# EAGLE design boost (EAGLE 8.6.0)
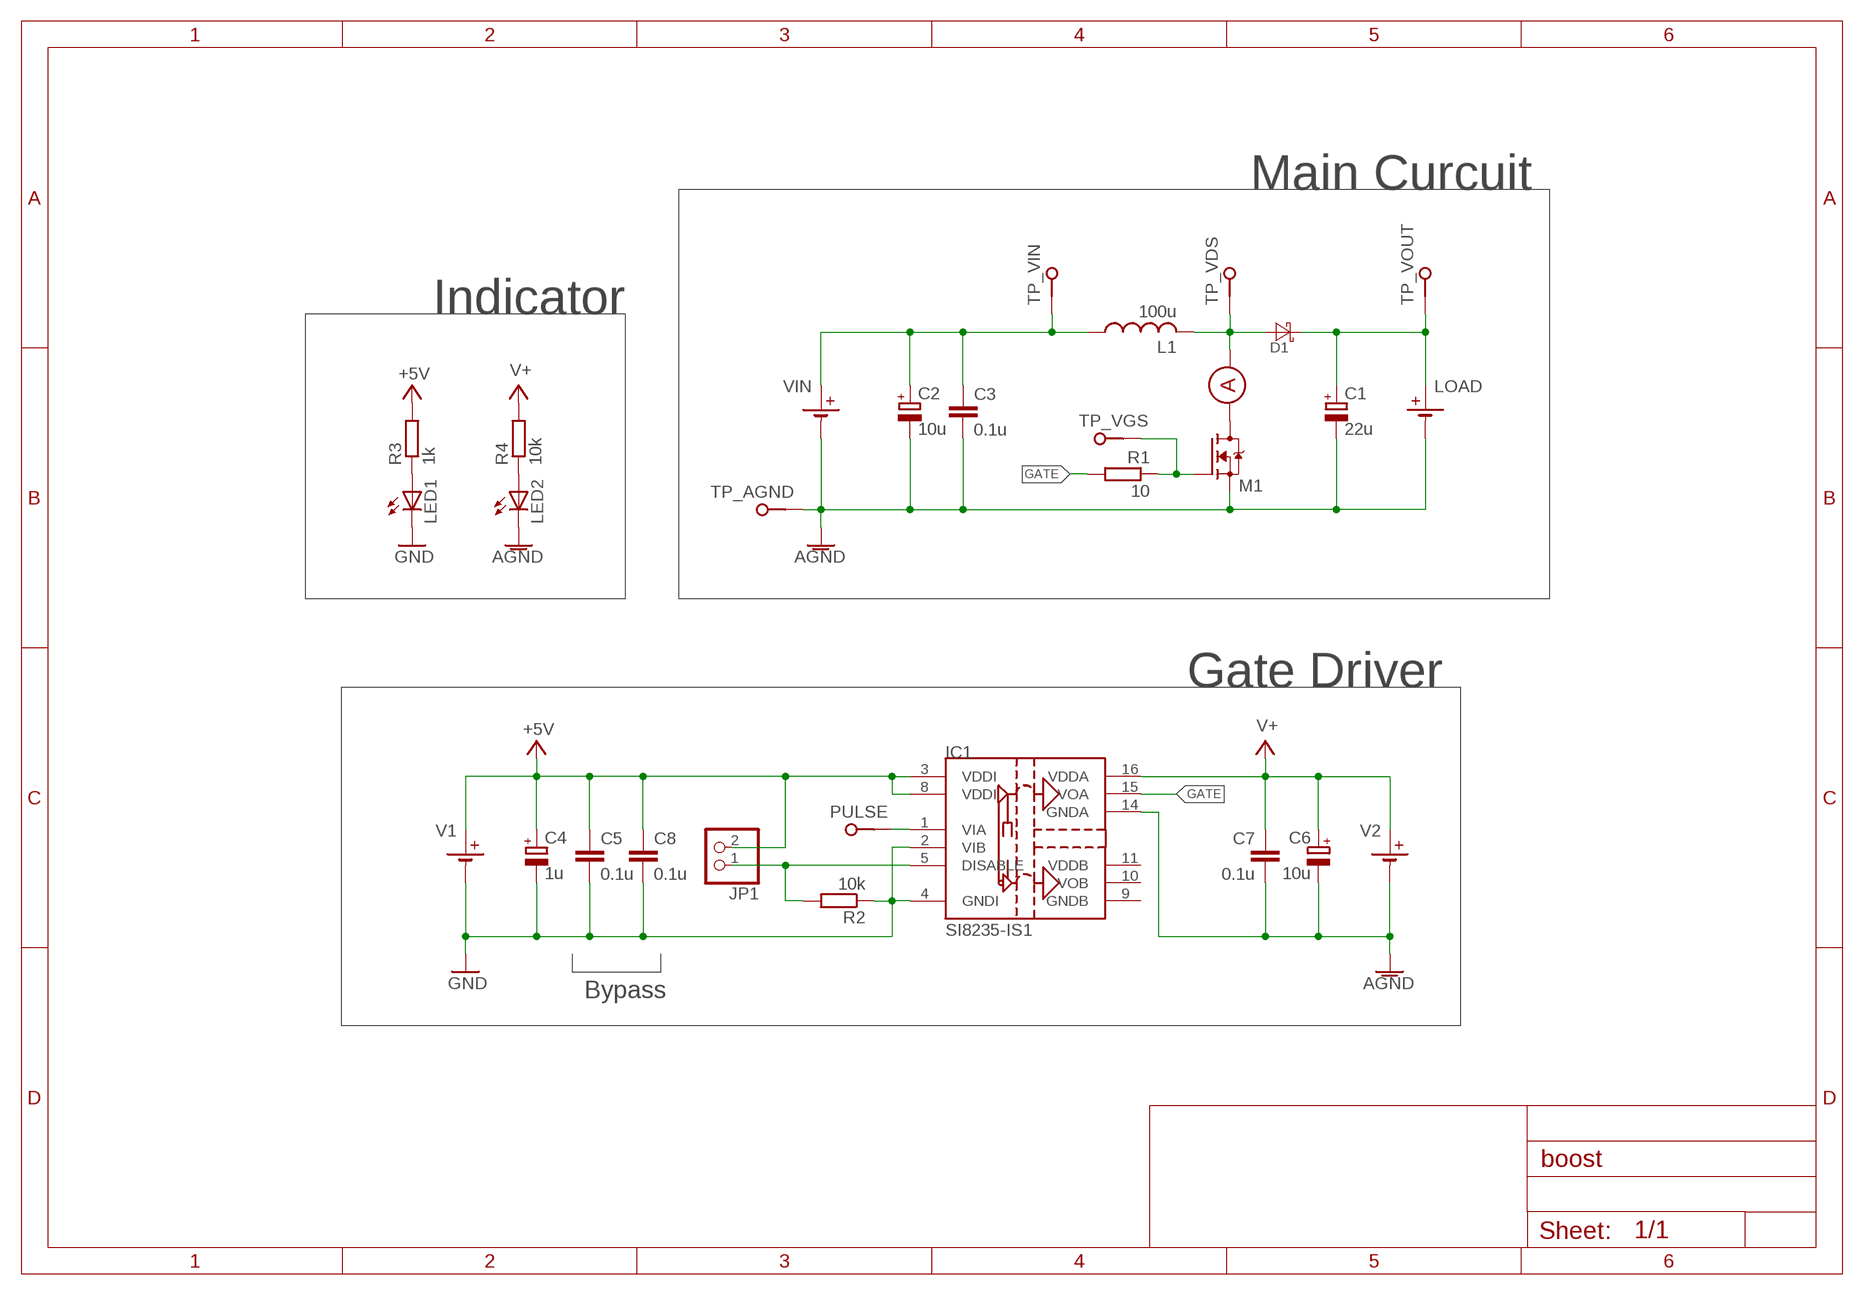
[diagram p0: schematic, sheet 1]

## Parts
C1  22u  CPOL-EUE5-10.5  [E5-10,5]
C2  10u  CPOL-EUE2.5-6  [E2,5-6]
C3  0.1u  C-EUC0805  [C0805]
C4  1u  CPOL-EUE2-5  [E2-5]
C5  0.1u  C-EUC0805  [C0805]
C6  10u  CPOL-EUE2.5-6  [E2,5-6]
C7  0.1u  C-EUC0805  [C0805]
C8  0.1u  C-EUC0805  [C0805]
D1  RB088LAM150TFTR  [SOD128]
IC1  SI8235-IS1  [SO16]
JP1  PINHD-1X2  [1X02]
L1  100u  L_MURATA  [MURATA_19RXXXC]
LED1  LEDCHIPLED_0805  [CHIPLED_0805]
LED2  LEDCHIPLED_0805  [CHIPLED_0805]
LOAD  POWER_SUPPLY_L  [SOURCE_HIGH]
M1  FET_ON_SOCKET  [ICTS-TO3P]
PULSE  PIN  [PIN]
R1  10  R-EU_R2512  [R2512]
R2  10k  R-EU_R0805  [R0805]
R3  1k  R-EU_R0805  [R0805]
R4  10k  R-EU_R0805  [R0805]
TP_AGND  PIN  [PIN]
TP_VDS  PIN  [PIN]
TP_VGS  PIN  [PIN]
TP_VIN  PIN  [PIN]
TP_VOUT  PIN  [PIN]
U$1  AMMETER  [AMMETER]
V1  POWER_SUPPLY  [526702AX]
V2  POWER_SUPPLY  [526702AX]
VIN  POWER_SUPPLY_L  [SOURCE_HIGH]

## Nets
+5V: C4.+ C5.1 C8.1 IC1.3(VDDI) IC1.8(VDDI) JP1.2 R3.2 V1.P
AGND: C1.- C2.- C3.2 C6.- C7.2 IC1.14(GNDA) LED2.C LOAD.N M1.S0(S) M1.S1(S) TP_AGND.1(KL) V2.N VIN.N
GATE: IC1.15(VOA) R1.2
GND: C4.- C5.2 C8.2 IC1.2(VIB) IC1.4(GNDI) LED1.C R2.1 V1.N
N$1: C2.+ C3.1 L1.1 TP_VIN.1(KL) VIN.P
N$2: D1.A L1.2 TP_VDS.1(KL) U$1.P$2
N$3: M1.G0(G) M1.G1(G) R1.1 TP_VGS.1(KL)
N$4: M1.D0(D) M1.D1(D) U$1.P$1
N$5: IC1.5(DISABLE) JP1.1 R2.2
N$6: IC1.1(VIA) PULSE.1(KL)
N$7: C1.+ D1.C LOAD.P TP_VOUT.1(KL)
N$8: LED1.A R3.1
N$9: LED2.A R4.1
V+: C6.+ C7.1 IC1.16(VDDA) R4.2 V2.P
Unconnected: IC1.10(VOB)

## Notes on the sheet
- Main Curcuit
- Indicator
- Gate Driver
- Bypass

## Power pins joined to a net without a drawn wire
GNDB: IC1.9(GNDB)
VDDB: IC1.11(VDDB)

## Library data of the parts
C1 C2 C6 = resistor:CPOL-EU: POLARIZED CAPACITOR, European symbol
C3 C5 C7 C8 = resistor:C-EU: CAPACITOR, European symbol
C4 = rcl:CPOL-EU: POLARIZED CAPACITOR, European symbol
D1 = hyoshioka:RB088LAM150TFTR
IC1 = lab:SI8235: Si8231/Si8234 Isolated dual 0.5/4A gate drivers Silicon Labs Si8231/34 single input high/low side isolated gate drivers. The Si823x series are dual isolated gate drivers. The '31 and '34 parts have a single PWM input with deadtime control and disable. The 8231 has dual 0.5A gate drivers, while the 8234 has 4A gate drivers. They require a 4.5-5.5V supply on the input side, and 6.5-24V on the gate driver side. The outputs are isolated from each other, and either can be used as a high side driver. Use a 0.1uF capacitor within 20mm of Vdd and Gnd on the input side, and at least 1uF on each driver supply. http://www.silabs.com/Support%20Documents/TechnicalDocs/Si823x.pdf Donald Becker
JP1 = pinhead:PINHD-1X2: PIN HEADER
L1 = lab:L_MURATA
LED1 LED2 = led:LED: LED OSRAM: - CHIPLED LG R971, LG N971, LY N971, LG Q971, LY Q971, LO R971, LY R971 LH N974, LH R974 LS Q976, LO Q976, LY Q976 LO Q996 - Hyper CHIPLED LW Q18S LB Q993, LB Q99A, LB R99A - SideLED LS A670, LO A670, LY A670, LG A670, LP A670 LB A673, LV A673, LT A673, LW A673 LH A674 LY A675 LS A676, LA A676, LO A676, LY A676, LW A676 LS A679, LY A679, LG A679 - Hyper Micro SIDELED® LS Y876, LA Y876, LO Y876, LY Y876 LT Y87S - SmartLED LW L88C, LW L88S LB L89C, LB L89S, LG L890 LS L89K, LO L89K, LY L89K LS L896, LA L896, LO L896, LY L896 - TOPLED LS T670, LO T670, LY T670, LG T670, LP T670 LSG T670, LSP T670, LSY T670, LOP T670, LYG T670 LG T671, LOG T671, LSG T671 LB T673, LV T673, LT T673, LW T673 LH T674 LS T676, LA T676, LO T676, LY T676, LB T676, LH T676, LSB T676, LW T676 LB T67C, LV T67C, LT T67C, LS T67K, LO T67K, LY T67K, LW E67C LS E67B, LA E67B, LO E67B, LY E67B, LB E67C, LV E67C, LT E67C LW T67C LS T679, LY T679, LG T679 LS T770, LO T770, LY T770, LG T770, LP T770 LB T773, LV T773, LT T773, LW T773 LH T774 LS E675, LA E675, LY E675, LS T675 LS T776, LA T776, LO T776, LY T776, LB T776 LHGB T686 LT T68C, LB T68C - Hyper Mini TOPLED® LB M676 - Mini TOPLED Santana® LG M470 LS M47K, LO M47K, LY M47K Source: http://www.osram.convergy.de LUXEON: - LUMILED® LXK2-PW12-R00, LXK2-PW12-S00, LXK2-PW14-U00, LXK2-PW14-V00 LXK2-PM12-R00, LXK2-PM12-S00, LXK2-PM14-U00 LXK2-PE12-Q00, LXK2-PE12-R00, LXK2-PE12-S00, LXK2-PE14-T00, LXK2-PE14-U00 LXK2-PB12-K00, LXK2-PB12-L00, LXK2-PB12-M00, LXK2-PB14-N00, LXK2-PB14-P00, LXK2-PB14-Q00 LXK2-PR12-L00, LXK2-PR12-M00, LXK2-PR14-Q00, LXK2-PR14-R00 LXK2-PD12-Q00, LXK2-PD12-R00, LXK2-PD12-S00 LXK2-PH12-R00, LXK2-PH12-S00 LXK2-PL12-P00, LXK2-PL12-Q00, LXK2-PL12-R00 Source: www.luxeon.com KINGBRIGHT: KA-3528ASYC Source: www.kingbright.com
LOAD VIN = lab:POWER_SUPPLY_L
M1 = lab:FET_ON_SOCKET
PULSE TP_AGND TP_VDS TP_VGS TP_VIN TP_VOUT = lab:PIN
R1-R4 = resistor:R-EU_: RESISTOR, European symbol
U$1 = lab:AMMETER
V1 V2 = lab:POWER_SUPPLY

## Board
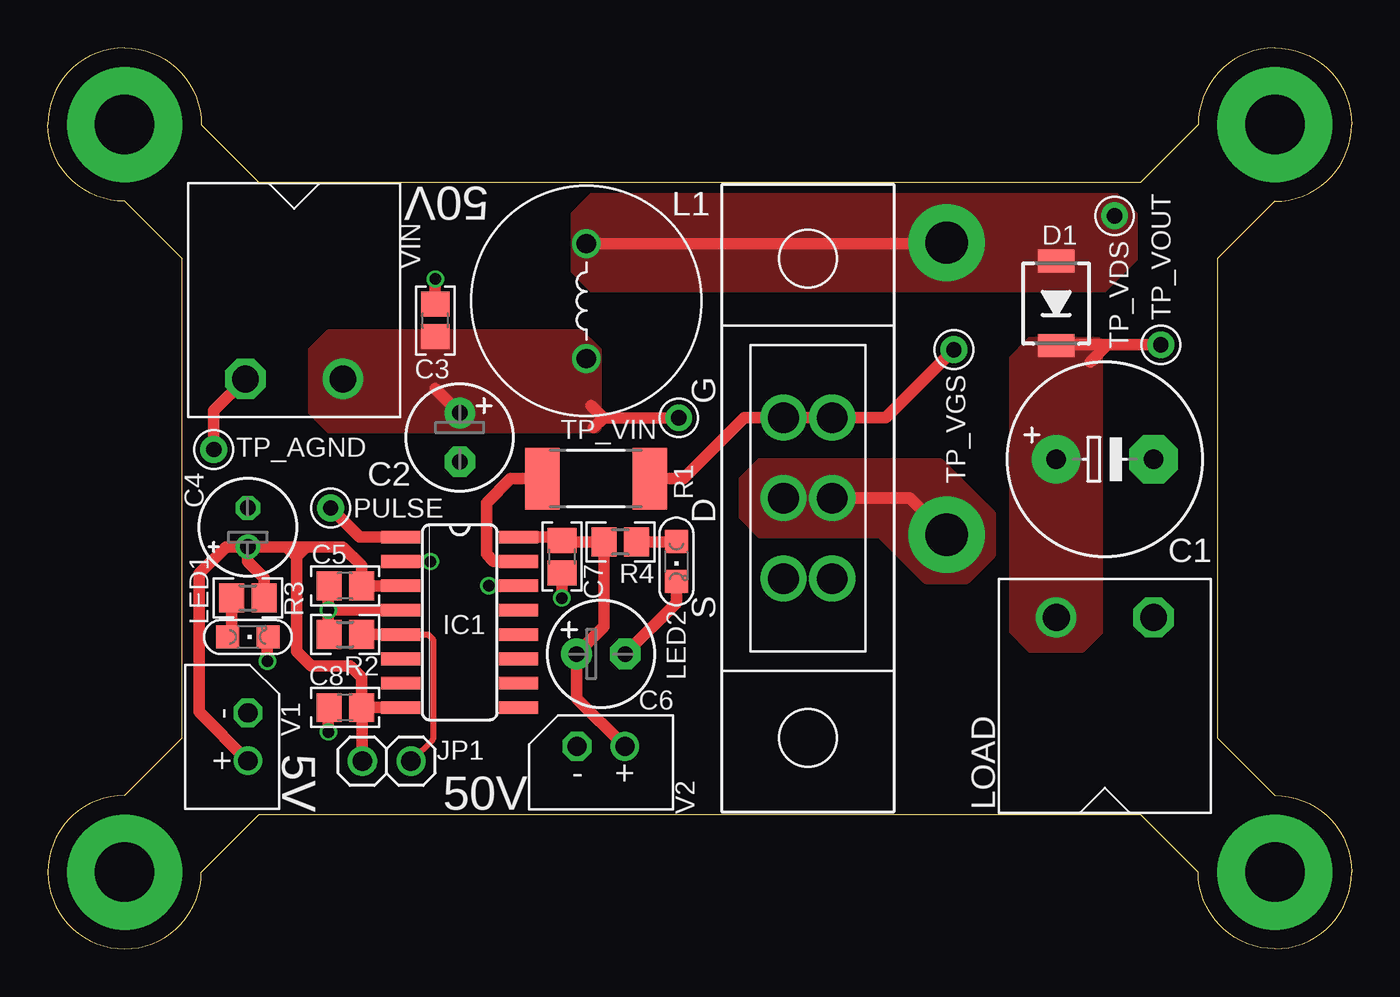
[diagram p1: board, top side]
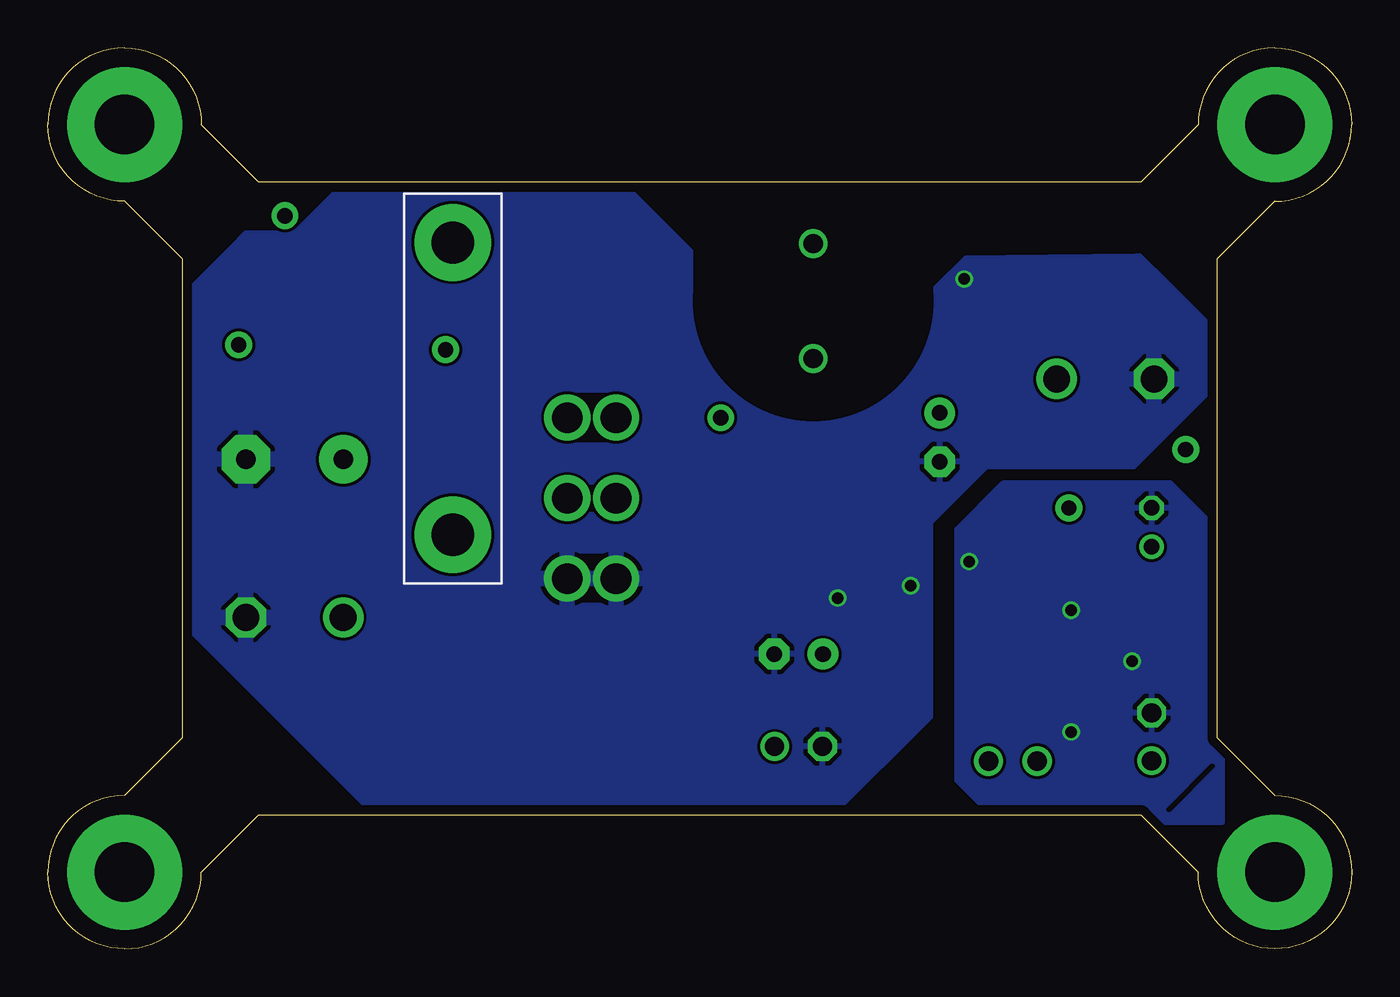
[diagram p2: board, bottom side, seen from below]

Size 68 x 47 mm. Coordinates in mm from the lower left corner, seen from the top.
Outline: 60,4 57,7 11,7 8,4 arc-90 4,0 arc-90 0,4 arc-90 4,8 7,11 7,36 4,39 arc-90 0,43 arc-90 4,47 arc-90 8,43 11,40 57,40 60,43 arc-90 64,47 arc-90 68,43 arc-90 64,39 61,36 61,11 64,8 arc-90 68,4 arc-90 64,0 arc-90 60,4
Copper layers (1*16): Top 0.035mm / dielectric 1.6mm / Bottom 0.035mm
Design rules "Elecrow_2-layer_PCB_eagle_rule": minimum track width 6mil, minimum drill 12mil, track to track 6mil, track to pad 6mil, pad to pad 6mil, via to via 8mil, smd to smd 0mil, copper to edge 20mil, drill to drill 10mil, minimum pad ring 6mil, minimum via ring 6mil, stop-mask expansion 0mil, vias tented up to drill 100mil, thermal gap 10mil
tRestrict: 12 lines
bRestrict: area 6.7,24.8 to 11.3,29.4; area 22.1,27.8 to 34.1,39.8; 17 lines

### Footprints (pad centres in the part's own frame; a part is rotated, then mirrored left to right if it is on the bottom)
E5-10,5 = drill 1.016 pad 2.54: + -2.54,0 | drill 1.016 pad 2.54 octagon: - 2.54,0
E2,5-6 = drill 0.813 pad 1.6: + -1.27,0 | drill 0.813 pad 1.6 octagon: - 1.27,0
C0805 = smd 1.3 x 1.5: 1 -0.85,0; 2 0.85,0
E2-5 = drill 0.813 pad 1.27: + -1.016,0 | drill 0.813 pad 1.27 octagon: - 1.016,0
SOD128 = smd 1.2 x 1.9: A 2.2,0; C -2.2,0
SO16 = smd 2.032 x 0.66: 1 -3.073,4.445; 2 -3.073,3.175; 3 -3.073,1.905; 4 -3.073,0.635; 5 -3.073,-0.635; 6 -3.073,-1.905; 7 -3.073,-3.175; 8 -3.073,-4.445; 9 3.073,-4.445; 10 3.073,-3.175; 11 3.073,-1.905; 12 3.073,-0.635; 13 3.073,0.635; 14 3.073,1.905; 15 3.073,3.175; 16 3.073,4.445
1X02 = drill 1.016: 1 -1.27,0; 2 1.27,0
MURATA_19RXXXC = drill 1: 1 -3,0; 2 3,0
CHIPLED_0805 = smd 1.2 x 1.2: A 0,-1.05; C 0,1.05
SOURCE_HIGH = drill 1.4 octagon: N 2.54,0 | drill 1.4: P -2.54,0
ICTS-TO3P = drill 1.6: D0 0,1.27; D1 0,-1.27; G0 -4.2,1.27; G1 -4.2,-1.27; S0 4.2,1.27; S1 4.2,-1.27
PIN = drill 0.8 pad 1.4: 1 0,0
R2512 = smd 1.8 x 3.2: 1 -2.8,0; 2 2.8,0
R0805 = smd 1.3 x 1.5: 1 -0.85,0; 2 0.85,0
AMMETER = drill 2.2 pad 4: P$1 -7.62,0; P$2 7.62,0
526702AX = drill 1 octagon: N -1.25,0 | drill 1: P 1.25,0

### Placement (x,y rotation side)
C1  55.13,25.54 0 top
C2  21.48,26.68 270 top
C3  20.21,32.78 90 top
C4  10.43,21.99 90 top
C5  15.51,18.94 180 top
C6  28.84,15.38 0 top
C7  26.81,20.46 270 top
C8  15.51,12.59 180 top
D1  52.59,33.67 90 top
IC1  21.48,17.03 0 top
JP1  17.67,9.79 180 top
L1  28.08,33.8 90 top
LED1  10.43,16.27 270 top
LED2  32.78,20.21 180 top
LOAD  55.13,17.29 0 top
M1  39.64,23.51 270 top
PULSE  14.75,23 90 top
R1  28.59,24.53 180 top
R2  15.51,16.4 0 top
R3  10.43,18.3 0 top
R4  29.86,21.22 180 top
TP_AGND  8.65,26.05 0 top
TP_VDS  55.64,38.24 0 top
TP_VGS  47.26,31.26 90 top
TP_VIN  32.91,27.7 180 top
TP_VOUT  58.05,31.51 90 top
U$1  46.88,29.23 90 bottom
V1  10.43,11.06 270 top
V2  28.84,10.56 0 top
VIN  12.84,29.73 180 top

### Tracks (layer width: path | path; a pad name or v marks a point on that pad's centre or on a via)
+5V
  Top 0.61: IC1.3 C5.1 16.36,19.99 15.38,20.97 13.48,20.97 | IC1.8 C8.1 | C4.+ 12.46,20.97 | 12.46,20.97 12.97,20.97 | 12.97,20.97 13.48,20.97 | C4.+ 9.29,20.97 7.89,19.57 7.89,12.35 V1.P | 12.97,20.97 12.97,20.46 | C8.1 16.36,14.15 15.76,14.75 13.73,14.75 12.97,15.51 12.97,19.45 12.97,20.46 | 11.28,18.72 R3.2 11.28,19.36 10.43,20.21 C4.+ | JP1.2 16.4,12.55 C8.1 | 12.97,20.46 12.46,20.97 | 12.97,20.46 13.48,20.97
AGND  (via drill 0.6)
  Top 0.61: IC1.14 v23,18.94 | C7.2 v26.81,18.3 | C6.- 32.78,18.05 LED2.C | TP_AGND.1 8.65,28.08 VIN.N | C3.2 v20.21,34.94
  pour Bottom (rank 2): 6.87,25.16 19.06,25.16 21.99,22.24 21.99,6.87 61.1,6.87 61.1,40.15 6.87,40.15
  pour Bottom: 55.77,27.83 55.77,23.26 62.63,23.26 62.63,27.83
  pour Bottom: 55.26,19.45 55.26,14.87 62.12,14.87 62.12,19.45
  pour Bottom: 36.21,21.48 36.21,16.91 43.07,16.91 43.07,21.48
  pour Bottom: 5.98,32.02 5.98,27.45 12.84,27.45 12.84,32.02
GATE
  Top 0.61: IC1.15 23.26,20.21 22.88,20.59 22.88,23.26 24.14,24.53 R1.2
GND  (via drill 0.6)
  Top 0.61: C8.2 14.62,12.55 v14.62,11.32 | C5.2 14.62,18.9 v14.62,17.67 | R2.1 14.62,16.44 v14.62,17.67 | LED1.C 11.45,16.24 v11.45,15 | IC1.4 v14.62,17.67 | IC1.2 v19.95,20.21
  pour Bottom: 6.75,24.27 18.18,24.27 20.59,21.86 20.59,6.62 6.75,6.62
N$1
  Top 0.61: 20.21,29.23 C2.+ | 28.97,27.7 28.34,28.34 | TP_VIN.1 28.97,27.7 | 28.97,27.7 28.46,27.19
  pour Top (no thermals): 13.86,32.02 13.86,27.19 28.59,27.19 28.59,32.02
N$2
  Top 0.61: L1.2 46.83,36.8 U$1.P$2
  pour Top (no thermals): 27.57,39.13 27.57,34.56 56.53,34.56 56.53,39.13
N$3
  Top 0.61: TP_VGS.1 43.71,27.71 M1.G0 M1.G1 36.35,27.71 33.16,24.53 R1.1
N$4
  Top 0.61: U$1.P$1 44.97,23.51 M1.D0
  pour Top (no thermals): 45.86,19.32 43.45,21.73 36.34,21.73 36.34,25.29 46.5,25.29 49.16,22.62 49.16,20.59 47.89,19.32
N$5
  Top 0.305: IC1.5 19.83,16.4 20.08,16.14 20.08,10.94 JP1.1
  Top 0.61: R2.2 IC1.5
N$6
  Top 0.61: PULSE.1 16.27,21.48 IC1.1
N$7
  Top 0.61: D1.C 52.63,31.51 TP_VOUT.1 55.26,31.51 54.37,30.62
  pour Top (no thermals): 50.43,31.64 50.43,15.76 54.75,15.76 54.75,31.64
N$8
  Top 0.61: LED1.A 9.58,16.47 R3.1
N$9
  Top 0.61: R4.1 32.75,21.22 LED2.A
N$10  (via drill 3.1 pad 6)
  other vias: 4,43
N$11  (via drill 3.1 pad 6)
  other vias: 4,4
N$12  (via drill 3.1 pad 6)
  other vias: 64,43
N$13  (via drill 3.1 pad 6)
  other vias: 64,4
V+
  Top 0.61: IC1.16 26.65,21.48 C7.1 26.9,21.22 R4.2 29.01,16.82 C6.+ 27.57,13.08 V2.P

### Text on the board
tPlace: 50V | 5V | 50V